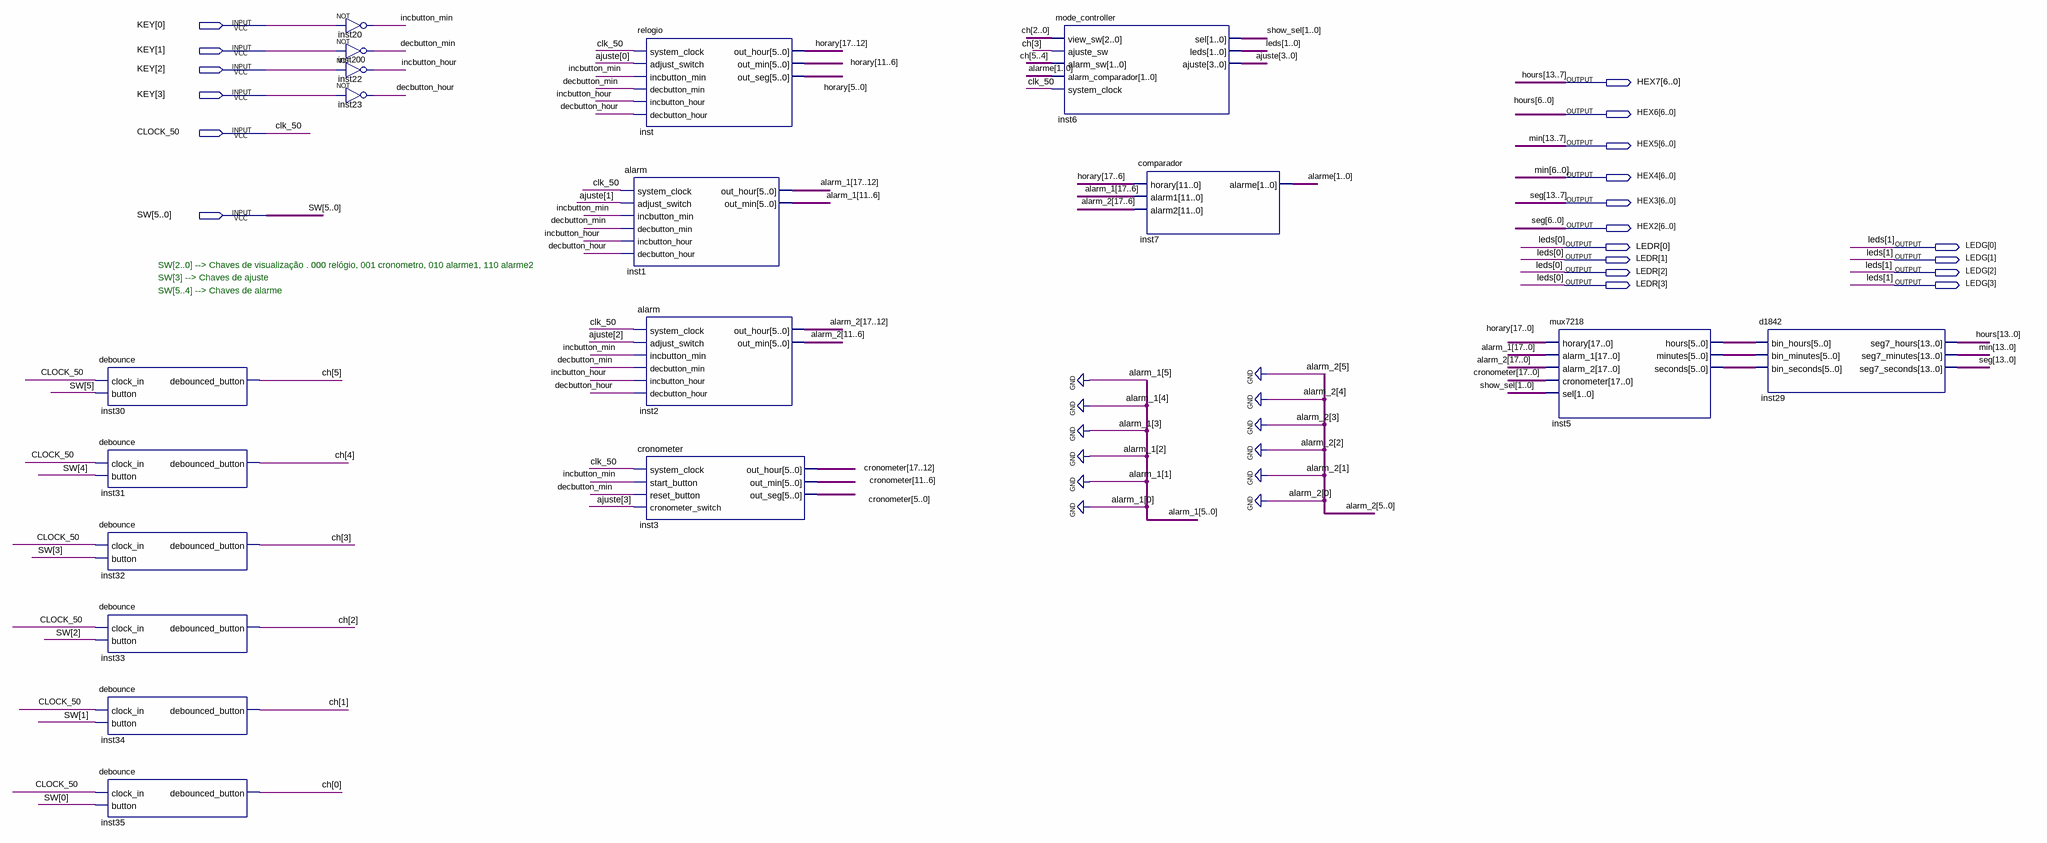
[diagram p0: schematic sheet]
// Quartus schematic digital_clock.bdf as structural Verilog: 18 symbols, 20 pins
module digital_clock (
  input  [3:0] KEY,
  input  CLOCK_50,
  input  [5:0] SW,
  output [6:0] HEX7,
  output [6:0] HEX6,
  output [6:0] HEX5,
  output [6:0] HEX4,
  output [6:0] HEX3,
  output [6:0] HEX2,
  output [3:0] LEDR,
  output [3:0] LEDG
);

  wire decbutton_hour, decbutton_min, incbutton_hour, incbutton_min;
  wire [1:0] alarme, show_sel;
  wire [3:0] ajuste;
  wire [5:0] ch, inst5_hours, inst5_minutes, inst5_seconds;
  wire [17:0] cronometer, horary;
  wire [17:6] alarm_1, alarm_2;

  debounce inst30 (.clock_in(CLOCK_50), .button(SW[5]), .debounced_button(ch[5]));
  debounce inst31 (.clock_in(CLOCK_50), .button(SW[4]), .debounced_button(ch[4]));
  debounce inst32 (.clock_in(CLOCK_50), .button(SW[3]), .debounced_button(ch[3]));
  debounce inst33 (.clock_in(CLOCK_50), .button(SW[2]), .debounced_button(ch[2]));
  debounce inst34 (.clock_in(CLOCK_50), .button(SW[1]), .debounced_button(ch[1]));
  debounce inst35 (.clock_in(CLOCK_50), .button(SW[0]), .debounced_button(ch[0]));
  not inst20 (incbutton_min, KEY[0]);
  not inst200 (decbutton_min, KEY[1]);
  not inst22 (incbutton_hour, KEY[2]);
  not inst23 (decbutton_hour, KEY[3]);
  alarm inst1 (
    .system_clock(CLOCK_50), .adjust_switch(ajuste[1]), .incbutton_min(incbutton_min),
    .decbutton_min(decbutton_min), .incbutton_hour(incbutton_hour), .decbutton_hour(decbutton_hour),
    .out_hour(alarm_1[17:12]), .out_min(alarm_1[11:6]));
  relogio inst (
    .system_clock(CLOCK_50), .adjust_switch(ajuste[0]), .incbutton_min(incbutton_min),
    .decbutton_min(decbutton_min), .incbutton_hour(incbutton_hour), .decbutton_hour(decbutton_hour),
    .out_hour(horary[17:12]), .out_min(horary[11:6]), .out_seg(horary[5:0]));
  alarm inst2 (
    .system_clock(CLOCK_50), .adjust_switch(ajuste[2]), .incbutton_min(incbutton_min),
    .decbutton_min(decbutton_min), .incbutton_hour(incbutton_hour), .decbutton_hour(decbutton_hour),
    .out_hour(alarm_2[17:12]), .out_min(alarm_2[11:6]));
  cronometer inst3 (
    .system_clock(CLOCK_50), .start_button(incbutton_min), .reset_button(decbutton_min),
    .cronometer_switch(ajuste[3]), .out_hour(cronometer[17:12]), .out_min(cronometer[11:6]),
    .out_seg(cronometer[5:0]));
  mode_controller inst6 (
    .view_sw(ch[2:0]), .ajuste_sw(ch[3]), .alarm_sw(ch[5:4]), .alarm_comparador(alarme),
    .system_clock(CLOCK_50), .sel(show_sel), .leds({LEDG[3], LEDR[3]}), .ajuste(ajuste));
  comparador inst7 (.horary(horary[17:6]), .alarm1(alarm_1), .alarm2(alarm_2), .alarme(alarme));
  mux7218 inst5 (
    .horary(horary), .alarm_1({alarm_1, {6{1'b0}}}), .alarm_2({alarm_2, {6{1'b0}}}), .cronometer(cronometer),
    .sel(show_sel), .hours(inst5_hours), .minutes(inst5_minutes), .seconds(inst5_seconds));
  d1842 inst29 (
    .bin_hours(inst5_hours), .bin_minutes(inst5_minutes), .bin_seconds(inst5_seconds),
    .seg7_hours({HEX7, HEX6}), .seg7_minutes({HEX5, HEX4}), .seg7_seconds({HEX3, HEX2}));

  assign LEDG[2:0] = {3{LEDG[3]}};
  assign LEDR[2:0] = {3{LEDR[3]}};

  // Other names for the same wires on the sheet: clk_50 = CLOCK_50; hours[13:0] = {HEX7, HEX6};
  //   leds[1:0] = {LEDG[3], LEDR[3]}; min[13:0] = {HEX5, HEX4}; seg[13:0] = {HEX3, HEX2}

  // Notes on the sheet:
  //   SW[2..0] --> Chaves de visualização . 000 relógio, 001 cronometro, 010 alarme1, 110 alarme2
  //   SW[3] --> Chaves de ajuste
  //   SW[5..4] --> Chaves de alarme
endmodule
